# Altium schematic sheet Power for Slaves.SchDoc
size A4
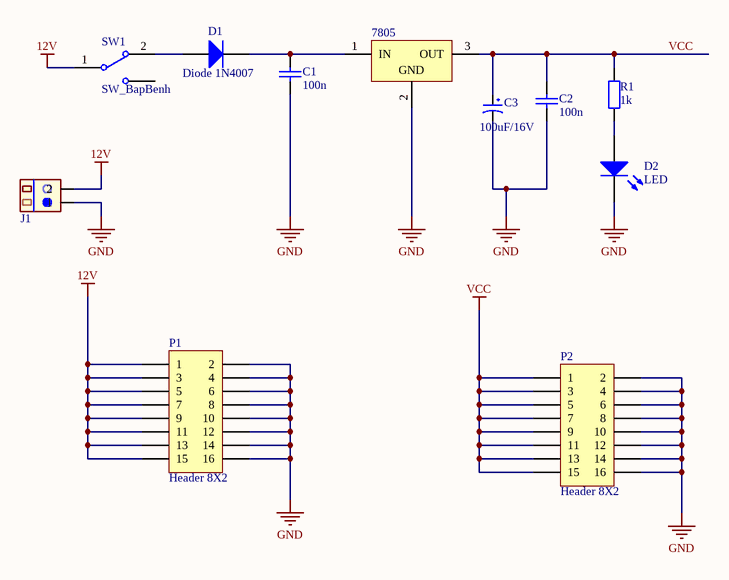
[diagram p0: Power for Slaves.SchDoc]

## Parts
7805  L78M05CP  [QTO-220]  (value not drawn)
C1  value 100n  [Cap Non-Pol 3mm]  (hidden comment: Cap Non-pol)
C2  value 100n  [Cap Non-Pol 3mm]  (hidden comment: Cap Non-pol)
C3  100uF/16V  [CP1.5/3.4]
D1  Diode 1N4007  [DO-41]
D2  LED  [LED-5mm RED]
J1  CON.Domino2  [Domino 2M]  (value not drawn)
P1  Header 8X2  [HDR2X8]
P2  Header 8X2  [HDR2X8]
R1  value 1k  [RESISTOR 1/4W]  (hidden comment: RES_SMD_0805)
SW1  SW_BapBenh  [SW_Bapbenh]

## Nets
12V: J1.2 P1.1 P1.3 P1.5 P1.7 P1.9 P1.11 P1.13 P1.15 SW1.1
GND: 7805.2(GND) C1.1 C2.1 C3.2 D2.2(K) J1.1 P1.2 P1.4 P1.6 P1.8 P1.10 P1.12 P1.14 P1.16 P2.2 P2.4 P2.6 P2.8 P2.10 P2.12 P2.14 P2.16
VCC: 7805.3(OUT) C2.2 C3.1 P2.1 P2.3 P2.5 P2.7 P2.9 P2.11 P2.13 P2.15 R1.2
Net7805_1: 7805.1(IN) C1.2 D1.2(K)
NetD1_1: D1.1(A) SW1.2
NetD2_1: D2.1(A) R1.1

## Library data of the parts
7805 = L78M05CP: Positive Voltage Regulator; Note: Tab is connected to pin 3 (GND).; Published: 24-Aug-2001; LatestRevisionDate: 17-Jul-2002; LatestRevisionNote: Re-released for DXP Platform.; DatasheetVersion: Apr-1994; PackageVersion: Jul-1998; PackageReference: ISOWATT220AB; Publisher: Altium Limited; PackageDescription: TO, Thru-Hole, Vertical, Heatsink Mounted; 3 In-Line Leads; Pitch 2.54 mm; Pin sequence 1, 3, 2; ComponentLink1Description: Manufacturer Link; ComponentLink1URL: http://www.st.com/; ComponentLink2Description: Datasheet; ComponentLink2URL: http://www.st.com/stonline/products/literature/ds/2146/l78m05c.pdf
C1 C2 = Cap Non-pol: Non-polarized Capacitor; Published: 8-Jun-2000; LatestRevisionDate: 17-Jul-2002; LatestRevisionNote: Re-released for DXP Platform.; PackageReference: RAD-0.3; Publisher: Altium Limited
C3 = CP3: Cap 100uF/35V - 470uF/16V; Value: 100uF/35V/50V; Description 1: 1000uF/6,3V - 470uF/16V - 330uF - 25V; Description 2: 220uF/35V - 100uF/50V - 63V - 4,7uF/200V; Description 3: 22uF => 33uF100V - 3,3uF => 4,7uF/250V; Description 4: 2,2uF =>3,3uF/350 - 2,2uF/400V - 1uF/450V
D1 = Diode 1N4007: 1 Amp General Purpose Rectifier; Published: 8-Jun-2000; LatestRevisionDate: 17-Jul-2002; LatestRevisionNote: Re-released for DXP Platform.; DatasheetVersion: 1998; PackageVersion: Aug-1999; PackageReference: DO-41; Publisher: Altium Limited; PackageDescription: Diode, Axial; Body 5.2 x 2.7 mm (LxDia. max), Lead Dia. 0.86 mm (max); Code_JEDEC: DO-204-AL; ComponentLink1Description: Manufacturer Link; ComponentLink1URL: http://www.fairchildsemi.com/; ComponentLink2Description: Datasheet; ComponentLink2URL: http://www.fairchildsemi.com/ds/1N%2F1N4001.pdf
D2 = LED: Typical LED; Published: 8-Jun-2000; LatestRevisionDate: 08-Jul-2005; LatestRevisionNote: Mech Layer 1 removed.; PackageReference: LED-1; Publisher: Altium Limited
J1 = CON.Domino2: 2 pins Domino Header; Publisher: Hoang Nguyen; ComponentLink1Description: Digikey Part link; ComponentLink2Description: Open DataSheet; ComponentLink2URL: H:\LIBRARY\LIBRARY.Datasheet\; Price: 2000VND
P1 P2 = Header 8X2: Header, 8-Pin, Dual row; LatestRevisionDate: 17-Jul-2002; LatestRevisionNote: Re-released for DXP Platform.; Publisher: Altium Limited
R1 = RES_SMD_0805: RES_0805; Published: 8-Jun-2000; LatestRevisionDate: 17-Jul-2002; LatestRevisionNote: Re-released for DXP Platform.; PackageReference: AXIAL-0.4; Publisher: Altium Limited